# Altium schematic sheet lcd_key_led.SchDoc
size A4; PageSetup: Record=PageOptions|CenterHorizontal=True|CenterVertical=True|PrintScale=1.04|XCorrection=1.00|YCorrection=1.00|PrintKind=0|BorderSize=5000000|LeftOffset=0|BottomOffset=0|Orientation=2|PaperLength=1000|PaperWidth=1000|Scale=100|PaperSource=7|PrintQuality=-4|MediaType=1|DitherType=10|PaperKind=A3|PrintScaleMode=1
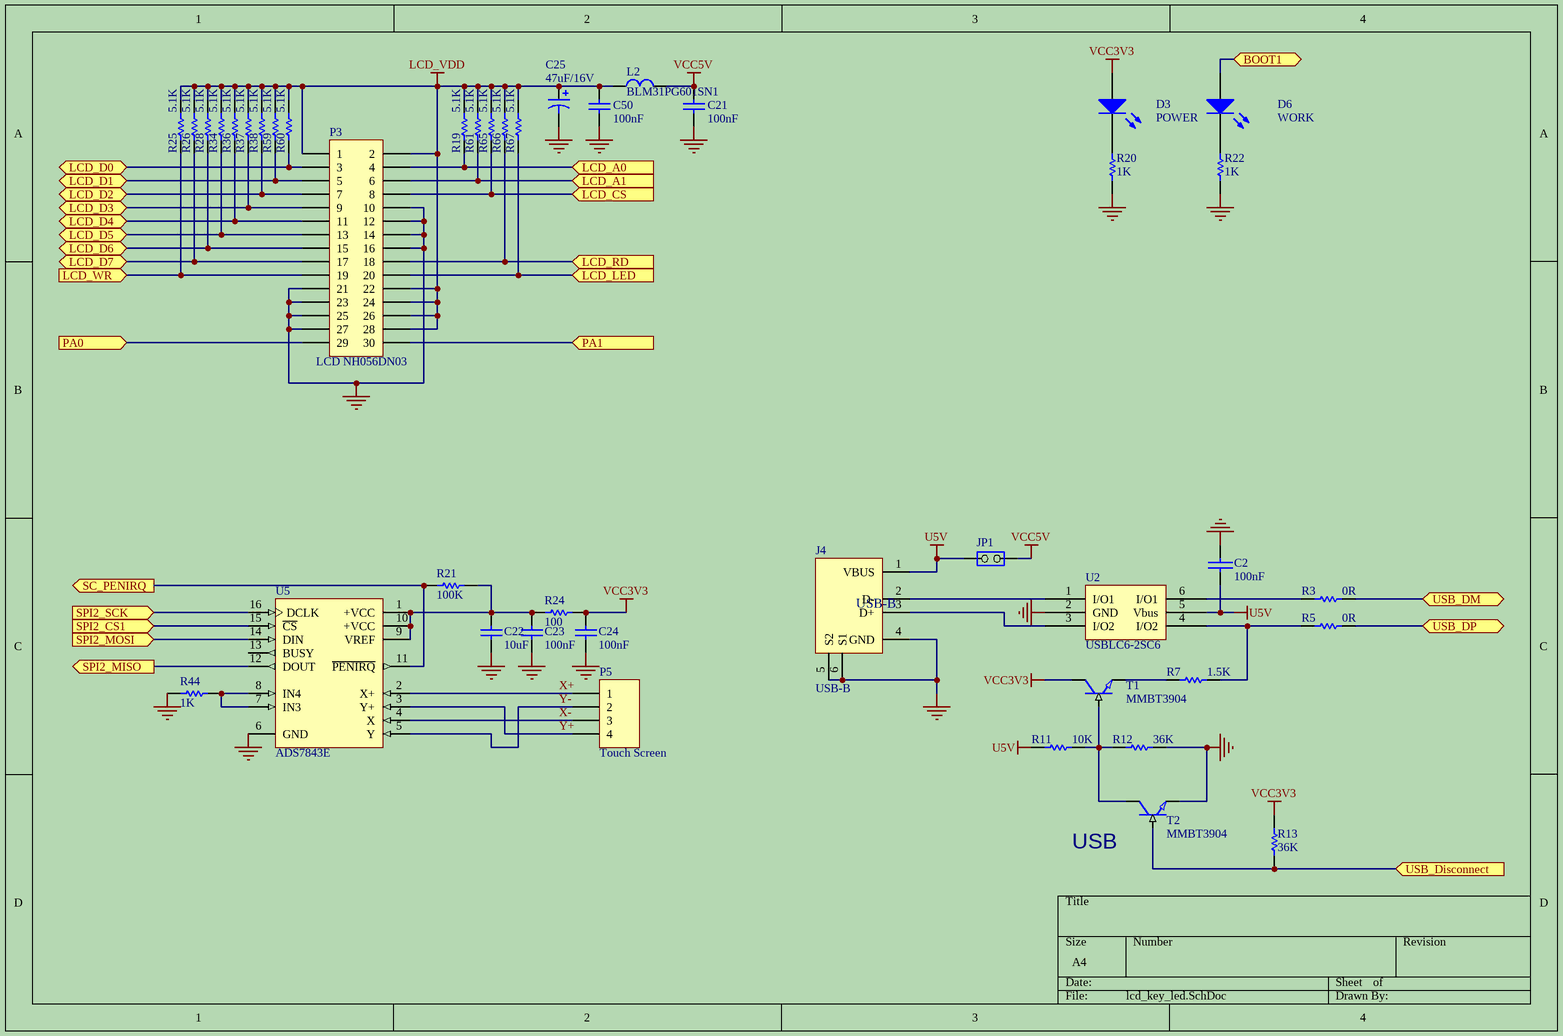
[diagram p0: lcd_key_led.SchDoc]

## Parts
C2  100nF  [C0805]
C21  100nF  [C0805]
C22  10uF  [C1206]
C23  100nF  [C0805]
C24  100nF  [C0805]
C25  47uF/16V  [CD1/2]
C50  100nF  [C0805]
D3  POWER  [LED0805]
D6  WORK  [LED0805]
J4  USB-B  [USB-B]
JP1  (no value)  [SIP2]
L2  BLM31PG601SN1  [l1206]
P3  LCD NH056DN03  [HDR2X15]
P5  Touch Screen  [TJC3-4A]
R3  0R  [R0805]
R5  0R  [R0805]
R7  1.5K  [R0805]
R11  10K  [R0805]
R12  36K  [R0805]
R13  36K  [R0805]
R19  5.1K  [R0805]
R20  1K  [R0805]
R21  100K  [R0805]
R22  1K  [R0805]
R24  100  [R0805]
R25  5.1K  [R0805]
R26  5.1K  [R0805]
R28  5.1K  [R0805]
R34  5.1K  [R0805]
R36  5.1K  [R0805]
R37  5.1K  [R0805]
R38  5.1K  [R0805]
R44  1K  [R0805]
R59  5.1K  [R0805]
R60  5.1K  [R0805]
R61  5.1K  [R0805]
R65  5.1K  [R0805]
R66  5.1K  [R0805]
R67  5.1K  [R0805]
T1  MMBT3904  [SOT-23]
T2  MMBT3904  [SOT-23]
U2  USBLC6-2SC6  [SOT-23/6]
U5  ADS7843E  [DBQ016]

## Ports
BOOT1, LCD_A0 (in), LCD_A1 (in), LCD_CS (in), LCD_D0, LCD_D1, LCD_D2, LCD_D3, LCD_D4, LCD_D5, LCD_D6, LCD_D7, LCD_LED (in), LCD_RD (in), LCD_WR (in), PA0 (in), PA1 (in), SC_PENIRQ (out), SPI2_CS1 (in), SPI2_MISO (out), SPI2_MOSI (in), SPI2_SCK (in), USB_Disconnect (in), USB_DM (bidir), USB_DP (bidir)

## Nets
GND: C2.1 C21.1 C22.1 C23.1 C24.1 C25.2 C50.1 J4.4(GND) J4.5(S2) J4.6(S1) P3.10 P3.12 P3.14 P3.16 P3.21 P3.23 P3.25 P3.27 R12.1 R20.2 R22.2 R44.1 T2.2(E) U2.2(GND) U5.6(GND)
LCD_VDD: C25.1 C50.2 L2.1 P3.1 P3.2 P3.22 P3.24 P3.26 P3.28 R19.1 R25.1 R26.1 R28.1 R34.1 R36.1 R37.1 R38.1 R59.1 R60.1 R61.1 R65.1 R66.1 R67.1
U5V: C2.2 J4.1(VBUS) JP1.2(NO) R11.2 U2.5(Vbus)
VCC3V3: C24.2 D3.1(A) R13.2 R24.2 T1.3(C)
VCC5V: C21.2 JP1.1(COMMON) L2.2
BOOT1: D6.1(A) ; port BOOT1
LCD_A0: P3.4 R19.2 ; port LCD_A0
LCD_A1: P3.6 R61.2 ; port LCD_A1
LCD_CS: P3.8 R65.2 ; port LCD_CS
LCD_D0: P3.3 R60.2 ; port LCD_D0
LCD_D1: P3.5 R59.2 ; port LCD_D1
LCD_D2: P3.7 R38.2 ; port LCD_D2
LCD_D3: P3.9 R37.2 ; port LCD_D3
LCD_D4: P3.11 R36.2 ; port LCD_D4
LCD_D5: P3.13 R34.2 ; port LCD_D5
LCD_D6: P3.15 R28.2 ; port LCD_D6
LCD_D7: P3.17 R26.2 ; port LCD_D7
LCD_LED: P3.20 R67.2 ; port LCD_LED
LCD_RD: P3.18 R66.2 ; port LCD_RD
LCD_WR: P3.19 R25.2 ; port LCD_WR
PA0: P3.29 ; port PA0
PA1: P3.30 ; port PA1
SC_PENIRQ: R21.1 U5.11(~{PENIRQ}) ; port SC_PENIRQ
SPI2_CS1: U5.15(~{CS}) ; port SPI2_CS1
SPI2_MISO: U5.12(DOUT) ; port SPI2_MISO
SPI2_MOSI: U5.14(DIN) ; port SPI2_MOSI
SPI2_SCK: U5.16(DCLK) ; port SPI2_SCK
USB_Disconnect: R13.1 T2.1(B) ; port USB_Disconnect
USB_DM: R3.1 ; port USB_DM
USB_DP: R5.1 ; port USB_DP
X+: P5.1 U5.2(X+)
X-: P5.3 U5.4(X)
Y+: P5.4 U5.3(Y+)
Y-: P5.2 U5.5(Y)
NetC22_2: C22.2 C23.2 R21.2 R24.1 U5.1(+VCC) U5.9(VREF) U5.10(+VCC)
NetD3_2: D3.2(K) R20.1
NetD6_2: D6.2(K) R22.1
NetJ4_2: J4.2(D-) U2.1(I/O1)
NetJ4_3: J4.3(D+) U2.3(I/O2)
NetR3_2: R3.2 U2.6(I/O1)
NetR5_2: R5.2 R7.1 U2.4(I/O2)
NetR7_2: R7.2 T1.2(E)
NetR11_1: R11.1 R12.2 T1.1(B) T2.3(C)
NetR44_2: R44.2 U5.7(IN3) U5.8(IN4)

Not connected (* = marked no-connect by the designer): U5 13(BUSY)

## Notes on the sheet
- (near T2) USB

## Library data of the parts
C2 = CAP: Capacitor
C21-C24 C50 = CAP: Capacitor; Value: 100pF; Published: 8-Jun-2000; Revision: July-2002: Re-released for DXP Platform.; Publisher: Altium Limited
C25 = Cap Pol1: Polarized Capacitor (Radial); Value: 100pF; Published: 8-Jun-2000; LatestRevisionDate: 17-Jul-2002; LatestRevisionNote: Re-released for DXP Platform.; PackageReference: RB7.6-15; Publisher: Altium Limited
D3 D6 = LED0: Typical INFRARED GaAs LED; Published: 8-Jun-2000; LatestRevisionDate: 08-Jul-2005; LatestRevisionNote: Mech Layer 1 removed.; PackageReference: LED-0; Publisher: Altium Limited
JP1 = JP2
L2 = L1
P3 = Header 15X2: Header, 15-Pin, Dual row; LatestRevisionDate: 17-Jul-2002; LatestRevisionNote: Re-released for DXP Platform.; Publisher: Altium Limited
P5 = Header 4: Header, 4-Pin; LatestRevisionDate: 17-Jul-2002; LatestRevisionNote: Re-released for DXP Platform.; Publisher: Altium Limited
R3 R5 R7 R11-R13 R19 R21 R24-R26 R28 R34 R36-R38 R59-R61 R65-R67 = Res1: Resistor; Value: 1K; Published: 8-Jun-2000; Publisher: Altium Limited
  R3 R5 R7 R11-R13: Revision: July-2002: Re-released for DXP Platform.
  R19 R21 R24-R26 R28 R34 R36-R38 R59-R61 R65-R67: LatestRevisionDate: 17-Jul-2002; LatestRevisionNote: Re-released for DXP Platform.; PackageReference: AXIAL-0.3
R20 R22 R44 = Res1: Resistor; Published: 8-Jun-2000; LatestRevisionDate: 17-Jul-2002; LatestRevisionNote: Re-released for DXP Platform.; PackageReference: AXIAL-0.3; Publisher: Altium Limited; Value: 1K
T1 T2 = NPN_SOT23: Text Field1: 22; Text Field2: 22
U2 = USBLC6-2
U5 = ADS7843E: 4-Wire Touch Screen Controller, 16-Pin SSOP, Pb-Free; Published: 6-Oct-2005; DatasheetVersion: May-2002; PackageVersion: Feb-2005; PackageReference: DBQ016; Publisher: Altium Limited; PackageDescription: SSOP; 16 Leads; Body Width 3.9 mm; Pitch 0.635 mm; Code_JEDEC: MO-137-AB; ComponentLink1Description: Manufacturer Link; ComponentLink1URL: http://focus.ti.com/docs/prod/folders/print/ads7843.html; ComponentLink2Description: Datasheet; ComponentLink2URL: http://focus.ti.com/lit/ds/symlink/ads7843.pdf